# EAGLE design 79x38 2P-BOB (EAGLE 9.6.2)
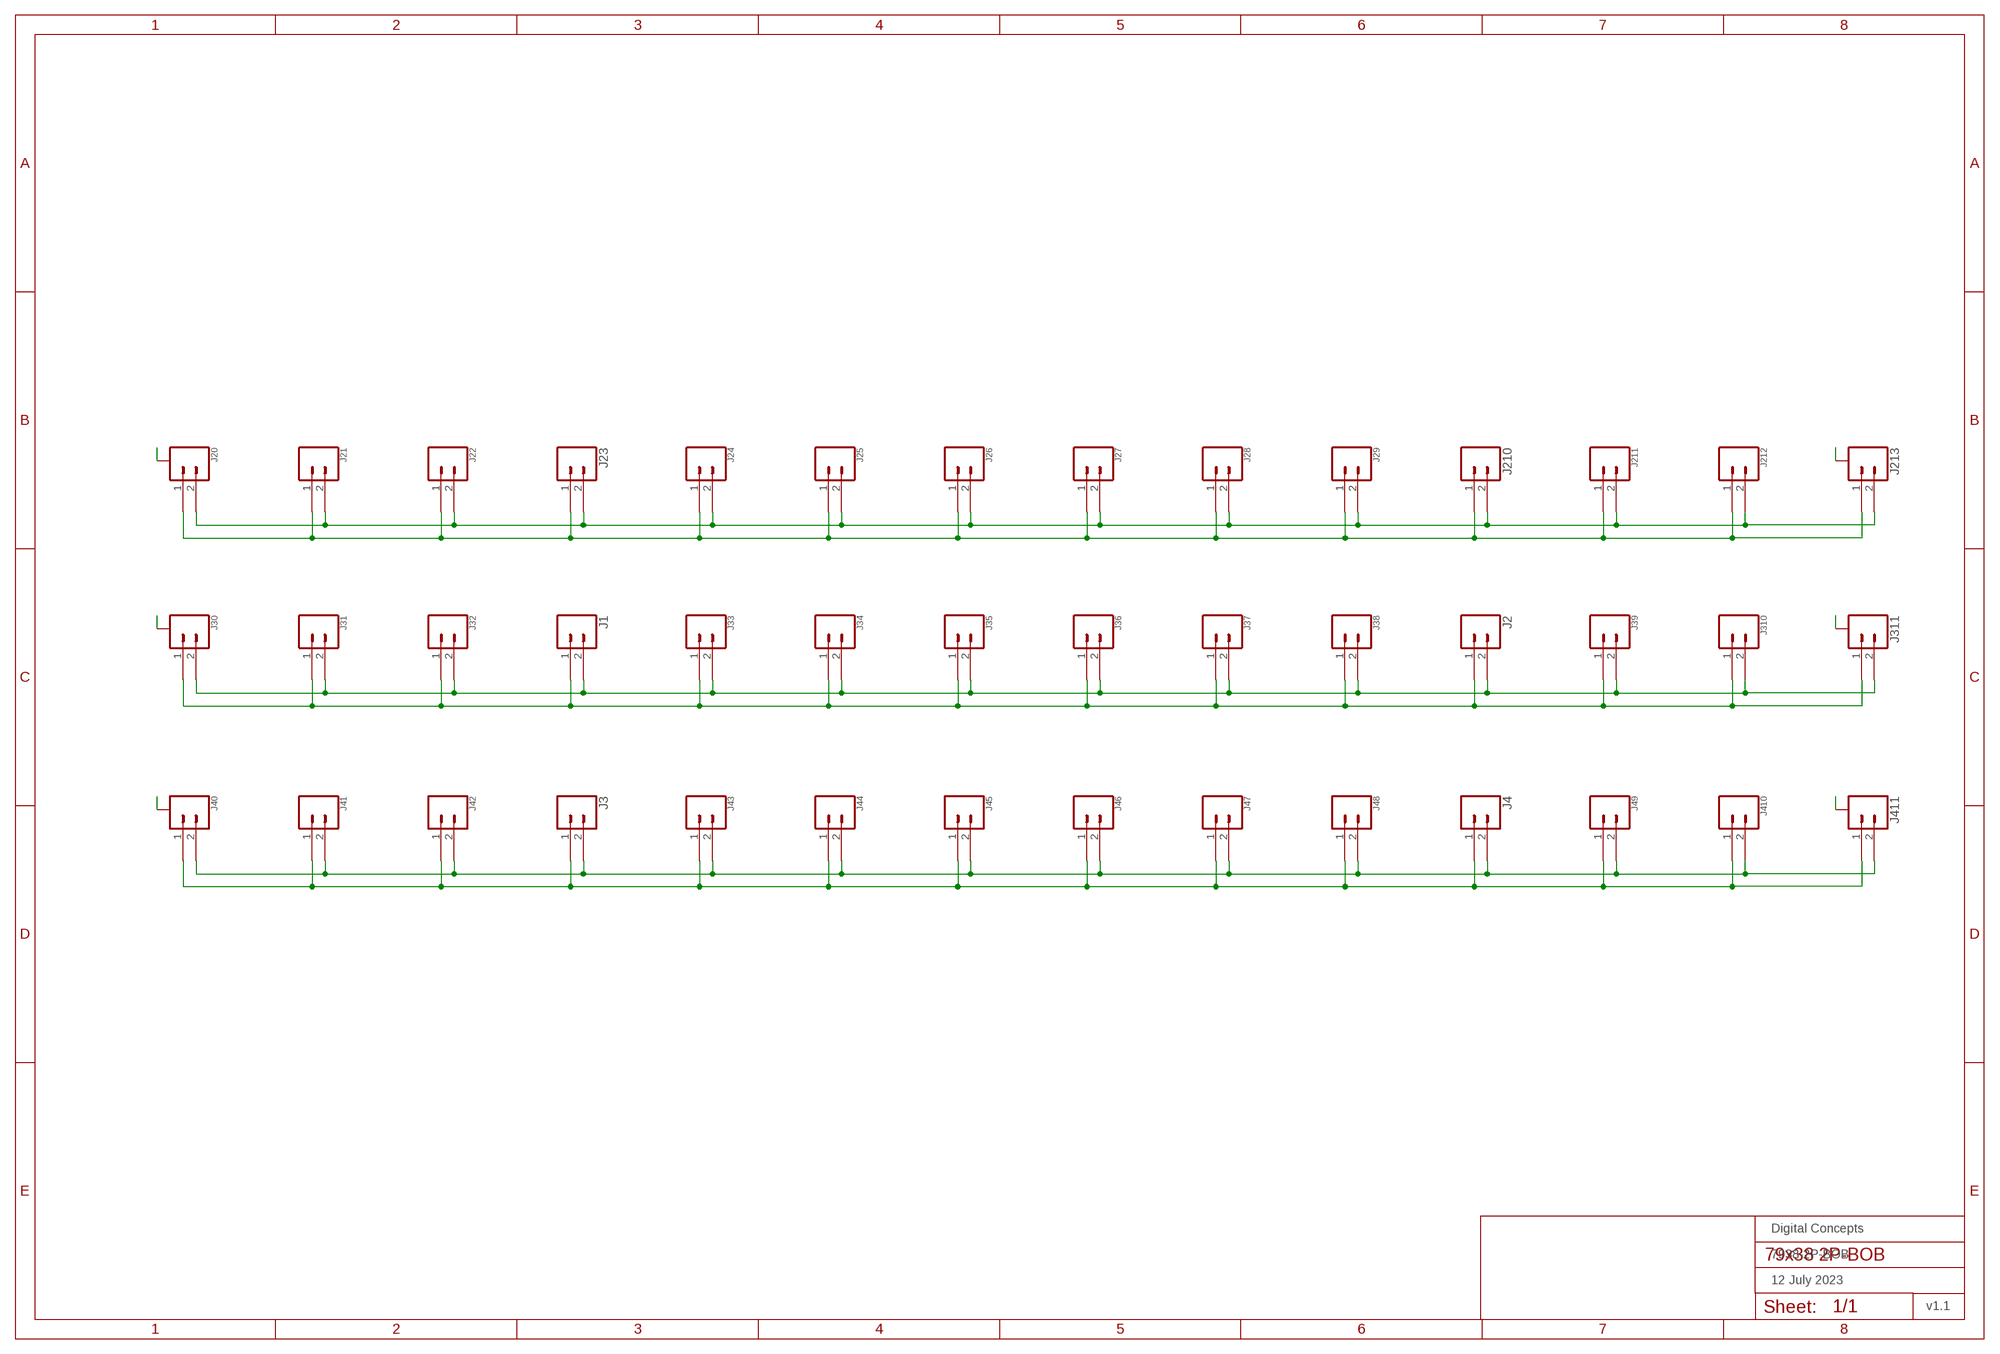
[diagram p0: schematic, sheet 1]
FRAME1 (FRAME-A3L-LOC): DATE: 12 July 2023; OWNER: Digital Concepts; TITLE: 7938-2P-BOB; VERSION: v1.1

## Parts
J1  JST-XH2.54-2-VERTICAL  [JST-XH2.4-2-VERTICAL]
J2  JST-XH2.54-2-VERTICAL  [JST-XH2.4-2-VERTICAL]
J3  JST-XH2.54-2-VERTICAL  [JST-XH2.4-2-VERTICAL]
J4  JST-XH2.54-2-VERTICAL  [JST-XH2.4-2-VERTICAL]
J20  JST-SH1.0-2-SMD-VERTICAL  [JST-SH1.0-2-VERTICAL]
J21  JST-GH1.25-2-VERTICAL  [JST-GH1.25-2-VERTICAL]
J22  JST-PH2.0-2-VERTICAL  [JST-PH2.0-2-VERTICAL]
J23  JST-XH2.54-2-VERTICAL  [JST-XH2.4-2-VERTICAL]
J24  HEADER-1X2-GENERIC  [CONN_02-GENERIC]
J25  HEADER-1X2-GENERIC  [CONN_02-GENERIC]
J26  HEADER-1X2-GENERIC  [CONN_02-GENERIC]
J27  HEADER-1X2-GENERIC  [CONN_02-GENERIC]
J28  HEADER-1X2-GENERIC  [CONN_02-GENERIC]
J29  HEADER-1X2-GENERIC  [CONN_02-GENERIC]
J30  JST-SH1.0-2-SMD-VERTICAL  [JST-SH1.0-2-VERTICAL]
J31  JST-GH1.25-2-VERTICAL  [JST-GH1.25-2-VERTICAL]
J32  JST-PH2.0-2-VERTICAL  [JST-PH2.0-2-VERTICAL]
J33  HEADER-1X2-GENERIC  [CONN_02-GENERIC]
J34  HEADER-1X2-GENERIC  [CONN_02-GENERIC]
J35  HEADER-1X2-GENERIC  [CONN_02-GENERIC]
J36  HEADER-1X2-GENERIC  [CONN_02-GENERIC]
J37  HEADER-1X2-GENERIC  [CONN_02-GENERIC]
J38  HEADER-1X2-GENERIC  [CONN_02-GENERIC]
J39  JST-PH2.0-2-VERTICAL  [JST-PH2.0-2-VERTICAL]
J40  JST-SH1.0-2-SMD-VERTICAL  [JST-SH1.0-2-VERTICAL]
J41  JST-GH1.25-2-VERTICAL  [JST-GH1.25-2-VERTICAL]
J42  JST-PH2.0-2-VERTICAL  [JST-PH2.0-2-VERTICAL]
J43  HEADER-1X2-GENERIC  [CONN_02-GENERIC]
J44  HEADER-1X2-GENERIC  [CONN_02-GENERIC]
J45  HEADER-1X2-GENERIC  [CONN_02-GENERIC]
J46  HEADER-1X2-GENERIC  [CONN_02-GENERIC]
J47  HEADER-1X2-GENERIC  [CONN_02-GENERIC]
J48  HEADER-1X2-GENERIC  [CONN_02-GENERIC]
J49  JST-PH2.0-2-VERTICAL  [JST-PH2.0-2-VERTICAL]
J210  JST-XH2.54-2-VERTICAL  [JST-XH2.4-2-VERTICAL]
J211  JST-PH2.0-2-VERTICAL  [JST-PH2.0-2-VERTICAL]
J212  JST-GH1.25-2-VERTICAL  [JST-GH1.25-2-VERTICAL]
J213  JST-SH1.0-2-SMD-VERTICAL  [JST-SH1.0-2-VERTICAL]
J310  JST-GH1.25-2-VERTICAL  [JST-GH1.25-2-VERTICAL]
J311  JST-SH1.0-2-SMD-VERTICAL  [JST-SH1.0-2-VERTICAL]
J410  JST-GH1.25-2-VERTICAL  [JST-GH1.25-2-VERTICAL]
J411  JST-SH1.0-2-SMD-VERTICAL  [JST-SH1.0-2-VERTICAL]

## Nets
A: J20.A@1(A) J20.A@2(A) J30.A@1(A) J30.A@2(A) J40.A@1(A) J40.A@2(A) J213.A@1(A) J213.A@2(A) J311.A@1(A) J311.A@2(A) J411.A@1(A) J411.A@2(A)
N$1: J20.1 J21.1 J22.1 J23.1 J24.1 J25.1 J26.1 J27.1 J28.1 J29.1 J210.1 J211.1 J212.1 J213.1
N$2: J1.2 J2.2 J30.2 J31.2 J32.2 J33.2 J34.2 J35.2 J36.2 J37.2 J38.2 J39.2 J310.2 J311.2
N$3: J1.1 J2.1 J30.1 J31.1 J32.1 J33.1 J34.1 J35.1 J36.1 J37.1 J38.1 J39.1 J310.1 J311.1
N$4: J3.2 J4.2 J40.2 J41.2 J42.2 J43.2 J44.2 J45.2 J46.2 J47.2 J48.2 J49.2 J410.2 J411.2
N$5: J3.1 J4.1 J40.1 J41.1 J42.1 J43.1 J44.1 J45.1 J46.1 J47.1 J48.1 J49.1 J410.1 J411.1
N$7: J20.2 J21.2 J22.2 J23.2 J24.2 J25.2 J26.2 J27.2 J28.2 J29.2 J210.2 J211.2 J212.2 J213.2

## Library data of the parts
J1-J4 J23 J210 = digitalconcepts:JST-XH2.54-2-VERTICAL: XH2.54 2P Vertical Connector
J20 J30 J40 J213 J311 J411 = digitalconcepts:JST-SH1.0-2-SMD-VERTICAL: JST SH1.0 2P SMD Vertical Connector
J21 J31 J41 J212 J310 J410 = digitalconcepts:JST-GH1.25-2-VERTICAL: JST GH1.25 2P PTH Connector
J22 J32 J39 J42 J49 J211 = digitalconcepts:JST-PH2.0-2-VERTICAL: PH2.0 2P Vertical Connector
J24-J29 J33-J38 J43-J48 = digitalconcepts:HEADER-1X2-GENERIC: Single Row 2-Pin Header

## Board
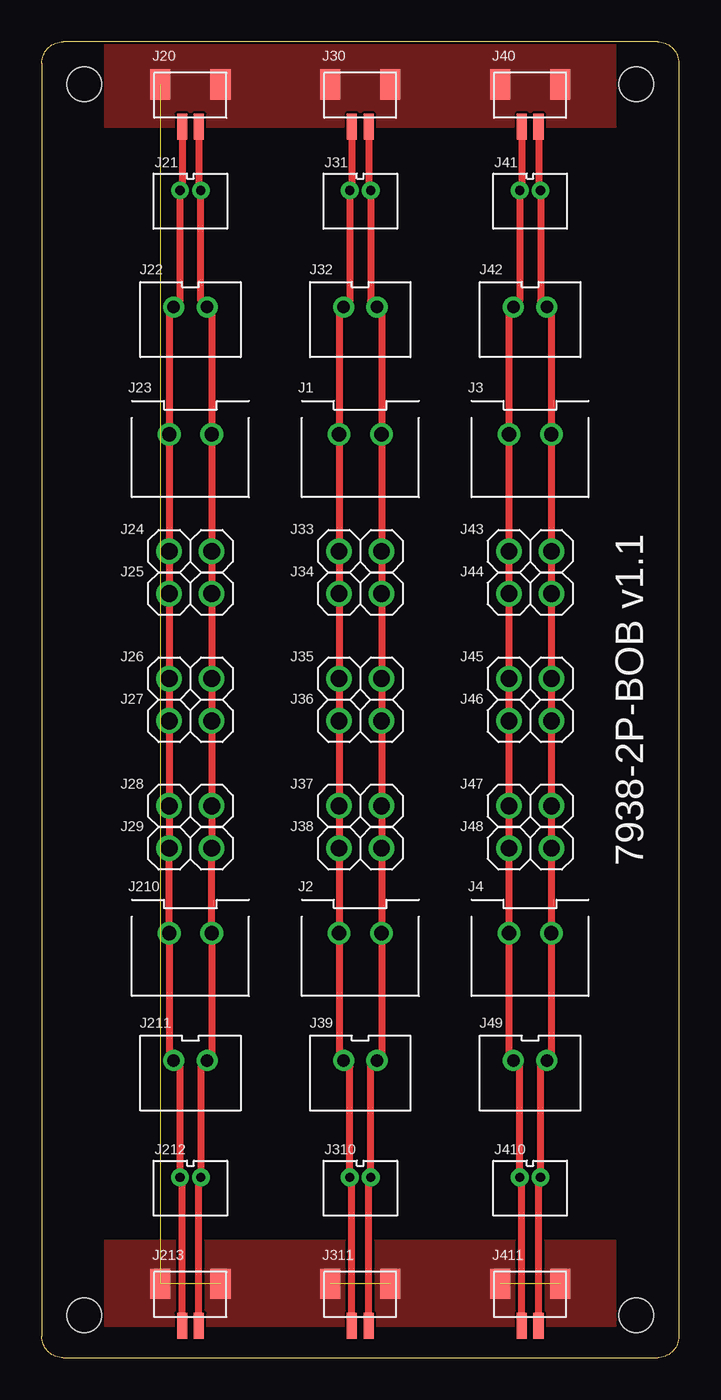
[diagram p1: board, top side]
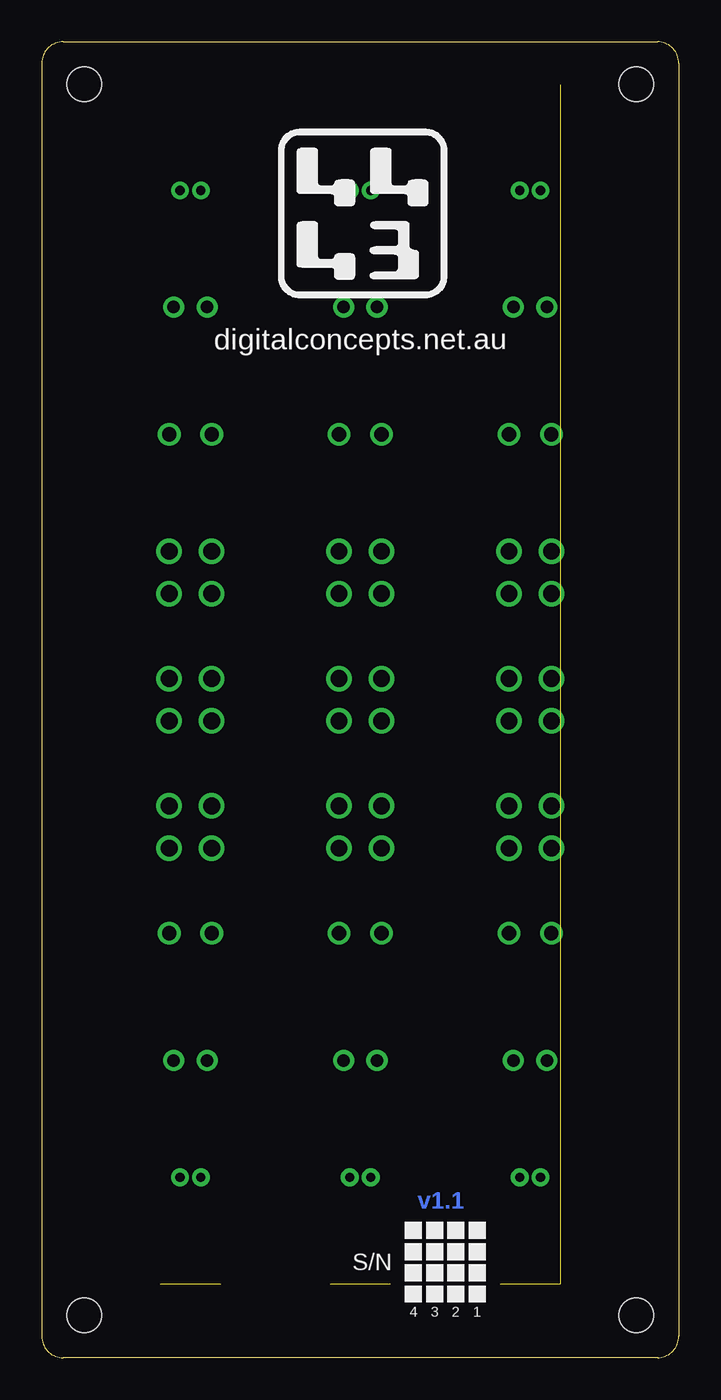
[diagram p2: board, bottom side, seen from below]

Size 38.1 x 78.74 mm. Coordinates in mm from the lower left corner, seen from the top.
Outline: 36.83,78.74 arc-90 38.1,77.47 38.1,1.27 arc-90 36.83,0 1.27,0 arc-90 0,1.27 0,77.47 arc-90 1.27,78.74 36.83,78.74
Copper layers (1*16): Top 0.035mm / dielectric 1.5mm / Bottom 0.035mm
Design rules "default *": minimum track width 6mil, minimum drill 0.35mm, track to track 6mil, track to pad 6mil, pad to pad 6mil, via to via 6mil, smd to smd 6mil, copper to edge 6mil, drill to drill 6mil, minimum pad ring 10mil, minimum via ring 8mil, stop-mask expansion 4mil, vias tented up to drill 0mil, thermal gap 0mil
Holes 2.03 mm at 2.54,76.2 2.54,2.54 35.56,2.54 35.56,76.2

### Footprints (pad centres in the part's own frame; a part is rotated, then mirrored left to right if it is on the bottom)
JST-XH2.4-2-VERTICAL = drill 0.85: 1 -1.27,0; 2 1.27,0
JST-SH1.0-2-VERTICAL = smd 0.6 x 1.55: 1 -0.5,-2.54; 2 0.5,-2.54 | smd 1.2 x 1.8: A@1 -1.8,-0.015; A@2 1.8,-0.015
JST-GH1.25-2-VERTICAL = drill 0.55 pad 1.016: 1 -0.625,0; 2 0.625,0
JST-PH2.0-2-VERTICAL = drill 0.75: 1 -1,0; 2 1,0
CONN_02-GENERIC = drill 1 pad 1.524: 1 0,0; 2 2.54,0

### Placement (x,y rotation side)
J1  19.05,55.24 0 top
J2  19.05,25.4 0 top
J3  29.21,55.24 0 top
J4  29.21,25.4 0 top
J20  8.89,76.2 0 top
J21  8.89,69.85 0 top
J22  8.89,62.87 0 top
J23  8.89,55.24 0 top
J24  7.62,48.26 0 top
J25  7.62,45.72 0 top
J26  7.62,40.64 0 top
J27  7.62,38.1 0 top
J28  7.62,33.02 0 top
J29  7.62,30.48 0 top
J30  19.05,76.2 0 top
J31  19.05,69.85 0 top
J32  19.05,62.87 0 top
J33  17.78,48.26 0 top
J34  17.78,45.72 0 top
J35  17.78,40.64 0 top
J36  17.78,38.1 0 top
J37  17.78,33.02 0 top
J38  17.78,30.48 0 top
J39  19.05,17.78 0 top
J40  29.21,76.2 0 top
J41  29.21,69.85 0 top
J42  29.21,62.87 0 top
J43  27.94,48.26 0 top
J44  27.94,45.72 0 top
J45  27.94,40.64 0 top
J46  27.94,38.1 0 top
J47  27.94,33.02 0 top
J48  27.94,30.48 0 top
J49  29.21,17.78 0 top
J210  8.89,25.4 0 top
J211  8.89,17.78 0 top
J212  8.89,10.79 0 top
J213  8.89,4.45 0 top
J310  19.05,10.79 0 top
J311  19.05,4.45 0 top
J410  29.21,10.79 0 top
J411  29.21,4.45 0 top

### Tracks (layer width: path | path; a pad name or v marks a point on that pad's centre or on a via)
A  (4 unrouted)
  pour Top: 3.81,78.74 34.29,78.74 34.29,73.66 3.81,73.66
  pour Top: 3.81,1.91 34.29,1.91 34.29,6.99 3.81,6.99
N$1
  Top 0.406: J20.1 8.39,69.97 J21.1 8.27,63.24 J22.1 7.62,62.59 J23.1 J24.1 J25.1 J26.1 J27.1 J28.1 J29.1 J210.1 7.62,18.05 J211.1 8.27,17.41 J212.1 8.39,10.67 J213.1
N$2
  Top 0.406: J30.2 19.55,69.97 J31.2 19.68,63.24 J32.2 20.32,62.59 J1.2 J33.2 J34.2 J35.2 J36.2 J37.2 J38.2 J2.2 20.32,18.05 J39.2 19.68,17.41 J310.2 19.55,10.67 J311.2
N$3
  Top 0.406: J30.1 18.55,69.97 J31.1 18.43,63.24 J32.1 17.78,62.59 J1.1 J33.1 J34.1 J35.1 J36.1 J37.1 J38.1 J2.1 17.78,18.05 J39.1 18.43,17.41 J310.1 18.55,10.67 J311.1
N$4
  Top 0.406: J40.2 29.71,69.97 J41.2 29.84,63.24 J42.2 30.48,62.59 J3.2 J43.2 J44.2 J45.2 J46.2 J47.2 J48.2 J4.2 30.48,18.05 J49.2 29.84,17.41 J410.2 29.71,10.67 J411.2
N$5
  Top 0.406: J40.1 28.71,69.97 J41.1 28.59,63.24 J42.1 27.94,62.59 J3.1 J43.1 J44.1 J45.1 J46.1 J47.1 J48.1 J4.1 27.94,18.05 J49.1 28.59,17.41 J410.1 28.71,10.67 J411.1
N$7
  Top 0.406: J20.2 9.39,69.97 J21.2 9.52,63.24 J22.2 10.16,62.59 J23.2 J24.2 J25.2 J26.2 J27.2 J28.2 J29.2 J210.2 10.16,18.05 J211.2 9.52,17.41 J212.2 9.39,10.67 J213.2

### Text on the board
Bottom: v1.1
tPlace: 7938-2P-BOB v1.1
bPlace: digitalconcepts.net.au | S/N | 1 | 2 | 3 | 4